# Altium schematic sheet 03-Actuators.SchDoc
size A4
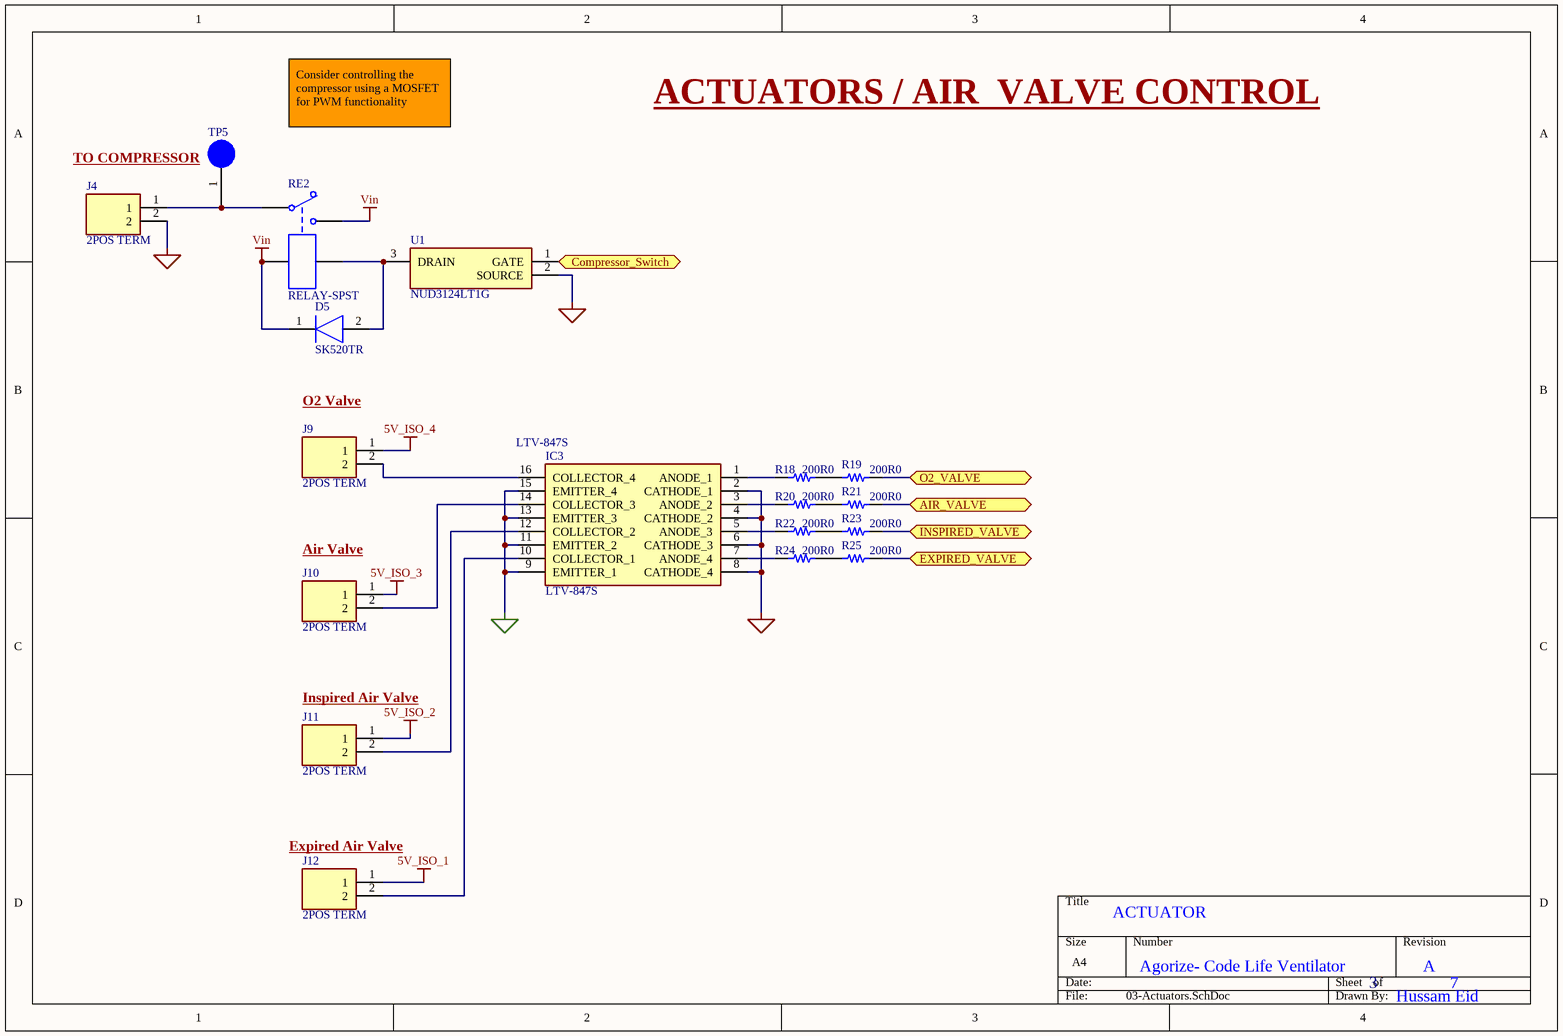
[diagram p0: 03-Actuators.SchDoc]

## Parts
D5  SK520TR  [DIOM8060X295N]
IC3  LTV-847S  [SOP254P1031X450-16N]
J4  2POS TERM  [SHDR2W110P0X500_1X2_1000X830X1140P]
J9  2POS TERM  [SHDR2W110P0X500_1X2_1000X830X1140P]
J10  2POS TERM  [SHDR2W110P0X500_1X2_1000X830X1140P]
J11  2POS TERM  [SHDR2W110P0X500_1X2_1000X830X1140P]
J12  2POS TERM  [SHDR2W110P0X500_1X2_1000X830X1140P]
R18  200R0  [RES 1206/3216]
R19  200R0  [RES 1206/3216]
R20  200R0  [RES 1206/3216]
R21  200R0  [RES 1206/3216]
R22  200R0  [RES 1206/3216]
R23  200R0  [RES 1206/3216]
R24  200R0  [RES 1206/3216]
R25  200R0  [RES 1206/3216]
RE2  RELAY-SPST  [JSM1A12V4]
TP5  TP  [TP]  (value not drawn)
U1  NUD3124LT1G  [SOT96P237X111-3N]

## Ports
AIR_VALVE (bidir), Compressor_Switch (bidir), EXPIRED_VALVE (bidir), INSPIRED_VALVE (bidir), O2_VALVE (bidir)

## Nets
5V_ISO_1: J12.1
5V_ISO_2: J11.1
5V_ISO_3: J10.1
5V_ISO_4: J9.1
COM: IC3.2(CATHODE_1) IC3.4(CATHODE_2) IC3.6(CATHODE_3) IC3.8(CATHODE_4) J4.2 U1.2(SOURCE)
COM_ISO: IC3.9(EMITTER_1) IC3.11(EMITTER_2) IC3.13(EMITTER_3) IC3.15(EMITTER_4)
Vin: D5.1(K) RE2.2 RE2.3
AIR_VALVE: R21.1 ; port AIR_VALVE
Compressor_Switch: U1.1(GATE) ; port Compressor_Switch
EXPIRED_VALVE: R25.1 ; port EXPIRED_VALVE
INSPIRED_VALVE: R23.1 ; port INSPIRED_VALVE
O2_VALVE: R19.1 ; port O2_VALVE
NetD5_2: D5.2(A) RE2.5 U1.3(DRAIN)
NetIC3_1: IC3.1(ANODE_1) R18.2
NetIC3_3: IC3.3(ANODE_2) R20.2
NetIC3_5: IC3.5(ANODE_3) R22.2
NetIC3_7: IC3.7(ANODE_4) R24.2
NetIC3_10: IC3.10(COLLECTOR_1) J12.2
NetIC3_12: IC3.12(COLLECTOR_2) J11.2
NetIC3_14: IC3.14(COLLECTOR_3) J10.2
NetIC3_16: IC3.16(COLLECTOR_4) J9.2
NetJ4_1: J4.1 RE2.1 TP5.1
NetR18_1: R18.1 R19.2
NetR20_1: R20.1 R21.2
NetR22_1: R22.1 R23.2
NetR24_1: R24.1 R25.2

## Notes on the sheet
- ACTUATORS / AIR  VALVE CONTROL
- TO COMPRESSOR
- Consider controlling the compressor using a MOSFET for PWM functionality
- O2 Valve
- (near J10) Air Valve
- (near J11) Inspired Air Valve
- (near J12) Expired Air Valve
- ACTUATOR
- Agorize- Code Life Ventilator
- 3
- A
- 7
- Hussam Eid

## Library data of the parts
D5 = SK520TR: DIODE SCHOTTKY 200V 5A SMC; Supplier 1: Digi-Key; Supplier Part Number 1: 1655-1603-1-ND; Manufacturer 1: SMC; Manufacturer Part Number 1: SK520TR; RoHS 1: No; Description 1: DIODE SCHOTTKY 200V 5A SMC; Stock 1: 19874; Pricing 1: 1 = 0.35000, 10 = 0.28500, 25 = 0.26040, 100 = 0.16360, 250 = 0.16176, 500 = 0.15148, 1000 = 0.10300 (USD); Mount: Surface Mount; Case/Package: SMC; Packaging: Tape and Reel; Max Reverse Voltage (DC): 200V; Average Rectified Current: 5A; ComponentLink1URL: http://www.smc-diodes.com/propdf/SK520%20N0107%20REV.A.pdf?src-supplier=Digi-Key; ComponentLink1Description: http://www.smc-diodes.com/propdf/SK520%20N0107%20REV.A.pdf?src-supplier=Digi-Key
IC3 = LTV-847S: OPTOISOLTR 5KV 4CH TRANS 16-SMD; Manufacturer 1: Vishay Lite-On; Forward Voltage: 1.4V; Rise Time: 18000ns; Number of Channels: 4; Collector Emitter Voltage (VCEO): 35V; Forward Current: 50mA; Collector Emitter Saturation Voltage: 200mV; Max Power Dissipation: 200mW; Current Transfer Ratio: 600%; Reverse Breakdown Voltage: 6V; Supplier 1: Digi-Key; Supplier Part Number 1: 160-1371-5-ND; Manufacturer Part Number 1: LTV-847S; RoHS 1: Yes; Description 1: OPTOISOLTR 5KV 4CH TRANS 16-SMD; Stock 1: 44348; Pricing 1: 1 = 1.02000, 10 = 0.82500, 100 = 0.50760, 500 = 0.43146, 1000 = 0.35532, 2500 = 0.33756, 5000 = 0.32994, 10000 = 0.32233, 25000 = 0.31725 (USD); Mount: Surface Mount; Case/Package: SMD/SMT; Number of Pins: 16; Min Operating Temperature: -30°C; Max Operating Temperature: 110°C; Packaging: Rail/Tube; Fall Time: 18000ns; Max Output Voltage: 35V; Output Current per Channel: 50mA; Max Input Current: 50mA; Isolation Voltage: 5kV; Max Collector Current: 50mA; Number of Elements: 4; Power Dissipation: 200mW; Package Quantity: 25; Number of Circuits: 4; Output Voltage: 35V; Radiation Hardening: No; Lead Free: Lead Free; ComponentLink1URL: https://datasheet.ciiva.com/11771/0900766b80de6da2-11771782.pdf?src-supplier=RSComponents; ComponentLink1Description: https://datasheet.ciiva.com/11771/0900766b80de6da2-11771782.pdf?src-supplier=RSComponents; ComponentLink2URL: https://datasheet.ciiva.com/15118/getdatasheetpartid-119507-15118694.pdf?src-supplier=Verical; ComponentLink2Description: https://datasheet.ciiva.com/15118/getdatasheetpartid-119507-15118694.pdf?src-supplier=Verical; ComponentLink3URL: https://datasheet.ciiva.com/2086/s-110-ltv-817827847m-s-s-ta-s-ta1-s-tpseries-2086410.pdf?src-supplier=Digi-Key; ComponentLink3Description: https://datasheet.ciiva.com/2086/s-110-ltv-817827847m-s-s-ta-s-ta1-s-tpseries-2086410.pdf?src-supplier=Digi-Key; ComponentLink4URL: https://datasheet.ciiva.com/16294/ltv-817-827-847-16294014.pdf?src-supplier=Future+Electronics; ComponentLink4Description: https://datasheet.ciiva.com/16294/ltv-817-827-847-16294014.pdf?src-supplier=Future+Electronics
J4 J9-J12 = 1935161: TERM BLK 2POS SIDE ENTRY 5MM PCB; Manufacturer 1: Phoenix Contact; Description 1: Conn Terminal Blocks 2 POS 5mm Solder ST Thru-Hole 16A; Connector Type: Screw; Voltage Rating (DC): 320V; Max Current Rating: 16A; Max Supply Voltage: 250V; Current Rating: 17.5A; Number of Poles: 2; Number of Levels: 1; Current: 18A; Voltage: 300V; Wire Gauge (Max): 26AWG; Wire Gauge (Min): 12AWG; Approvals: UL; ComponentLink1URL: https://datasheet.ciiva.com/15169/getdatasheetpartid-177903-15169663.pdf?src-supplier=Verical; ComponentLink1Description: https://datasheet.ciiva.com/15169/getdatasheetpartid-177903-15169663.pdf?src-supplier=Verical; ComponentLink2URL: https://datasheet.ciiva.com/16047/1935161-16047247.pdf?src-supplier=Onlinecomponents.com; ComponentLink2Description: https://datasheet.ciiva.com/16047/1935161-16047247.pdf?src-supplier=Onlinecomponents.com; ComponentLink3URL: https://datasheet.ciiva.com/824/combiconcompact5-0mmseries-824222.pdf?src-supplier=Digi-Key; ComponentLink3Description: https://datasheet.ciiva.com/824/combiconcompact5-0mmseries-824222.pdf?src-supplier=Digi-Key; Supplier 1: Digi-Key; Supplier Part Number 1: 277-1667-ND; Manufacturer Part Number 1: 1935161; RoHS 1: Yes; Stock 1: 32563; Pricing 1: 1 = 0.43000, 10 = 0.41100, 50 = 0.39280, 100 = 0.38200, 250 = 0.35700, 500 = 0.32844, 1000 = 0.30350 (USD); Mount: Through Hole; Number of Pins: 2; Weight: 0.067021oz; Contact Material: Copper,Tin; Insulation Material: Nylon; Housing Material: Polyamide; Housing Color: Green; Color: Green; Material: Nylon; Number of Rows: 1; Voltage Rating: 250V; Package Quantity: 250; Packaging: Bulk; Number of Positions: 2; Number of Positions Per Level: 2; Termination: Solder; Number of Contacts: 2; Number of Circuits: 2; Orientation: Straight; Length: 9mm; Height: 11.3mm; Width: 14.9mm; Pitch: 5mm; Depth: 9mm; Wire/Cable Gauge: 26AWG; Radiation Hardening: No; Flammability Rating: UL94 V-0; Lead Free: Lead Free; REACH SVHC: Unknown
R18-R25 = ERJ-8ENF1002V: RES SMD 10K OHM 1% 1/4W 1206; Manufacturer 1: Yageo; Manufacturer Part Number 1: RC1206FR-07200RL; Description 1: Res Thick Film 1206 200 Ohm 1% 0.25W(1/4W) ±100ppm/C Molded SMD Paper T/R; Temperature Coefficient: 100ppm/°C; Resistance: 200R; Voltage Rating (DC): 200V; Power Rating: 250mW; ComponentLink1Description: Datasheet; ComponentLink1URL: http://industrial.panasonic.com/www-cgi/jvcr13pz.cgi?E+PZ+3+AOA0002+ERJ8ENF1002V+7+WW; ComponentLink2Description: Digi-Key listing; ComponentLink2URL: http://digikey.com/product-detail/en/ERJ-8ENF1002V/P10.0KFTR-ND/89059; Supplier 1: Digi-Key; Supplier Part Number 1: 311-200FRCT-ND; RoHS 1: Yes; Stock 1: 2870115; Pricing 1: 1 = 0.10000, 10 = 0.07100, 100 = 0.02910, 1000 = 0.01306, 2500 = 0.01134 (USD); Mount: Surface Mount; Case/Package: 1206; Weight: 0.000571oz; Case Code (Metric): 3216; Case Code (Imperial): 1206; Min Operating Temperature: -55°C; Max Operating Temperature: 155°C; Composition: Thick Film; Tolerance: 1%; Packaging: Tape and Reel; Termination: SMD/SMT; Military Standard: Not; Voltage Rating: 200V; Length: 3.1mm; Height: 0.55mm; Width: 1.6mm; Depth: 1.6mm; Lead Free: Lead Free; ComponentLink3URL: https://datasheet.ciiva.com/11808/0900766b80c6630a-11808603.pdf?src-supplier=RSComponents; ComponentLink3Description: https://datasheet.ciiva.com/11808/0900766b80c6630a-11808603.pdf?src-supplier=RSComponents
RE2 = RELAY-SPST: RELAY AUTOMOTIVE SPST 15A 12V; Manufacturer 1: Panasonic; Manufacturer Part Number 1: JSM1A-12V-5; Max Voltage Rating (DC): 16V; Power Consumption: 640mW; Coil Current: 53.3mA; Operate Time: 10ms; Coil Resistance: 225R; Coil Type: Non-Latching; Supplier 1: Digi-Key; Supplier Part Number 1: 255-2815-ND; RoHS 1: Yes; Description 1: RELAY AUTOMOTIVE SPST 15A 12V; Stock 1: 2893; Pricing 1: 1 = 1.75000, 10 = 1.64300, 25 = 1.46000, 50 = 1.38700, 100 = 1.31400, 250 = 1.16800, 500 = 1.09500, 1000 = 1.02200, 5000 = 0.98550 (USD); Mount: Through Hole; Number of Pins: 4; Weight: 12g; Contact Material: Silver,Cadmium; Min Operating Temperature: -40°C; Max Operating Temperature: 85°C; Max Current Rating: 15A; Package Quantity: 100; Packaging: Bulk; Contact Current Rating: 15A; Throw Configuration: SPST; Release Time: 10ms; Termination: PC Pin; Coil Power: 640mW; Relay Type: Automotive; Coil Voltage (DC): 12V; Lead Free: Lead Free; ComponentLink1URL: https://datasheet.ciiva.com/2408/ds-61211-en-jsm-pd-2408039.pdf?src-supplier=Digi-Key; ComponentLink1Description: https://datasheet.ciiva.com/2408/ds-61211-en-jsm-pd-2408039.pdf?src-supplier=Digi-Key
TP5 = TP: Test Point
U1 = NUD3124LT1G: IC PWR DRVR N-CHAN 1:1 SOT23-3; Manufacturer 1: ON Semiconductor; Description 1: Trans MOSFET N-CH 28V 0.15A 3-Pin SOT-23 T/R; Output Configuration: Low Side; Rise Time: 708ns; Max Supply Voltage: 28V; Number of Outputs: 1; Max Output Current: 150mA; Gate to Source Voltage (Vgs): 12V; Power Dissipation: 225mW; Interface: On/Off; Output Current: 200mA; On-State Resistance: 1.4R; Element Configuration: Single; Drain to Source Resistance: 800mR; Supplier 1: Digi-Key; Supplier Part Number 1: NUD3124LT1GOSCT-ND; Manufacturer Part Number 1: NUD3124LT1G; RoHS 1: Yes; Stock 1: 48744; Pricing 1: 1 = 0.40000, 10 = 0.34200, 25 = 0.31880, 100 = 0.23690, 250 = 0.20044, 500 = 0.19132, 1000 = 0.14121 (USD); Mount: Surface Mount; Case/Package: SOT-23; Number of Pins: 3; Contact Plating: Tin,Matte; Min Operating Temperature: -40°C; Max Operating Temperature: 125°C; Packaging: Tape and Reel; Package Quantity: 3000; Continuous Drain Current (ID): 150mA; Number of Elements: 1; Number of Drivers: 1; Output Voltage: 28V; Current Rating: 200mA; Drain to Source Voltage (Vdss): 28V; Drain to Source Breakdown Voltage: 28V; Fall Time: 708ns; Length: 3.04mm; Height: 1.01mm; Width: 1.4mm; Radiation Hardening: No; Lead Free: Lead Free; Halogen Free: Halogen Free; REACH SVHC: No SVHC; ComponentLink1URL: https://datasheet.ciiva.com/1955/nud3124-d-1955016.pdf?src-supplier=Digi-Key; ComponentLink1Description: https://datasheet.ciiva.com/1955/nud3124-d-1955016.pdf?src-supplier=Digi-Key; ComponentLink2URL: https://datasheet.ciiva.com/11168/nud3124-d-11168232.pdf?src-supplier=Avnet; ComponentLink2Description: https://datasheet.ciiva.com/11168/nud3124-d-11168232.pdf?src-supplier=Avnet; ComponentLink3URL: https://datasheet.ciiva.com/1955/nud3124-d-1955017.pdf?src-supplier=Digi-Key; ComponentLink3Description: https://datasheet.ciiva.com/1955/nud3124-d-1955017.pdf?src-supplier=Digi-Key; ComponentLink4URL: https://datasheet.ciiva.com/16486/nud3124-d-16486430.pdf?src-supplier=Avnet+Asia; ComponentLink4Description: https://datasheet.ciiva.com/16486/nud3124-d-16486430.pdf?src-supplier=Avnet+Asia; ComponentLink5URL: https://datasheet.ciiva.com/1955/nud3124-d-1955015.pdf?src-supplier=Digi-Key; ComponentLink5Description: https://datasheet.ciiva.com/1955/nud3124-d-1955015.pdf?src-supplier=Digi-Key; ComponentLink6URL: https://datasheet.ciiva.com/1609/1792914-1609179.pdf?src-supplier=Newark; ComponentLink6Description: https://datasheet.ciiva.com/1609/1792914-1609179.pdf?src-supplier=Newark; ComponentLink7URL: https://datasheet.ciiva.com/26145/nud3124-d-26145435.pdf?src-supplier=Avnet+Europe; ComponentLink7Description: https://datasheet.ciiva.com/26145/nud3124-d-26145435.pdf?src-supplier=Avnet+Europe; ComponentLink8URL: https://datasheet.ciiva.com/11166/nud3124-d-11166028.pdf?src-supplier=Avnet; ComponentLink8Description: https://datasheet.ciiva.com/11166/nud3124-d-11166028.pdf?src-supplier=Avnet; ComponentLink9URL: https://datasheet.ciiva.com/16200/nud3124-d-16200989.pdf?src-supplier=Future+Electronics; ComponentLink9Description: https://datasheet.ciiva.com/16200/nud3124-d-16200989.pdf?src-supplier=Future+Electronics